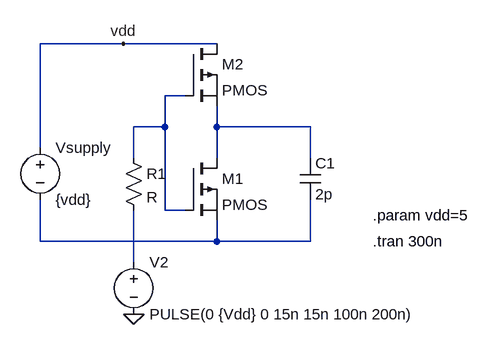
[diagram p0: schematic PMOS.asc]
PMOS.asc, the LTspice schematic file:
Version 4
SHEET 1 880 680
WIRE 176 -16 48 -16
WIRE 320 -16 176 -16
WIRE 272 64 240 64
WIRE 240 112 240 64
WIRE 240 112 192 112
WIRE 320 112 320 80
WIRE 464 112 320 112
WIRE 48 144 48 -16
WIRE 192 160 192 112
WIRE 320 160 320 112
WIRE 464 160 464 112
WIRE 240 240 240 112
WIRE 272 240 240 240
WIRE 48 288 48 224
WIRE 320 288 320 256
WIRE 320 288 48 288
WIRE 464 288 464 224
WIRE 464 288 320 288
WIRE 192 320 192 240
FLAG 192 400 0
FLAG 176 -16 vdd
SYMBOL voltage 48 128 R0
WINDOW 123 0 0 Left 2
WINDOW 39 0 0 Left 2
SYMATTR InstName Vsupply
SYMATTR Value {vdd}
SYMBOL cap 448 160 R0
SYMATTR InstName C1
SYMATTR Value 2p
SYMBOL res 176 144 R0
SYMATTR InstName R1
SYMBOL voltage 192 304 R0
WINDOW 123 0 0 Left 2
WINDOW 39 0 0 Left 2
SYMATTR InstName V2
SYMATTR Value PULSE(0 {Vdd} 0 15n 15n 100n 200n)
SYMBOL pmos 272 160 R0
SYMATTR InstName M1
SYMBOL pmos 272 -16 R0
SYMATTR InstName M2
TEXT 560 248 Left 2 !.param vdd=5
TEXT 560 288 Left 2 !.tran 300n

The netlist it stands for:
* PMOS.asc
Vsupply vdd N003 {vdd}
C1 N002 N003 2p
R1 N001 N004 R
V2 N004 0 PULSE(0 {Vdd} 0 15n 15n 100n 200n)
M1 N002 N001 N003 N003 PMOS
M2 vdd N001 N002 N002 PMOS
.model NMOS NMOS
.model PMOS PMOS
.lib standard.mos
.param vdd=5
.tran 300n
.backanno
.end